# Altium schematic sheet 04. Z-WAVE.SchDoc
size A
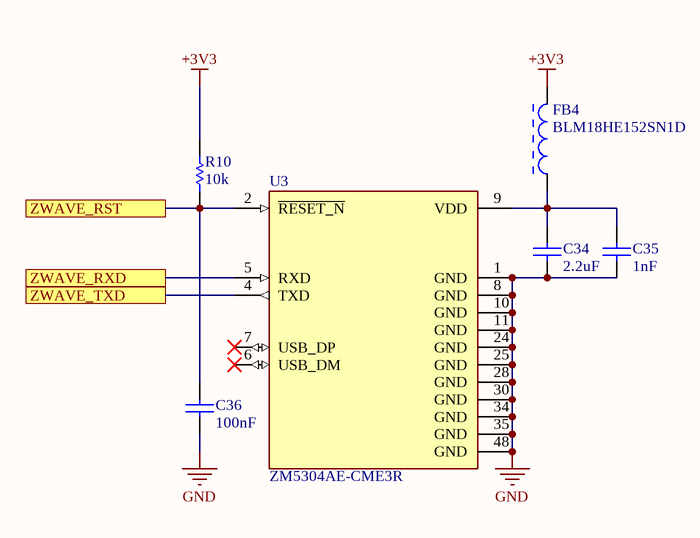
[diagram p0: 04. Z-WAVE.SchDoc]

## Parts
C34  2.2uF  [CAPC1608X90X35NL10T15]
C35  1nF  [CAPC1005X55X25NL05T10]
C36  100nF  [CAPC1005X56X25NL10T15]
FB4  BLM18HE152SN1D  [MURA-BLM18-RF-H4-CHIP-2_V]
R10  10k  [RESC1005X40X25NL05T05]
U3  ZM5304AE-CME3R  [ZM5304AE-CME3R]

## Ports
ZWAVE_RST, ZWAVE_RXD, ZWAVE_TXD

## Nets
+3V3: FB4.2 R10.2
GND: C34.1 C35.1 C36.1 U3.1(GND) U3.8(GND) U3.10(GND) U3.11(GND) U3.24(GND) U3.25(GND) U3.28(GND) U3.30(GND) U3.34(GND) U3.35(GND) U3.48(GND)
ZWAVE_RST: C36.2 R10.1 U3.2(~{RESET_N}) ; port ZWAVE_RST
ZWAVE_RXD: U3.5(RXD) ; port ZWAVE_RXD
ZWAVE_TXD: U3.4(TXD) ; port ZWAVE_TXD
NetC34_2: C34.2 C35.2 FB4.1 U3.9(VDD)

Not connected (* = marked no-connect by the designer): U3 6(USB_DM)* 7(USB_DP)*

## Library data of the parts
C34 = CMP-2006-02354-1: Manufacturer: Murata; Part Number: GCM188R70J225KE22D
C35 = CMP-2008-04254-1: Part Number: GRM1555C1H102JA01D; Manufacturer: Murata
C36 = CMP-2008-02743-1: Manufacturer: AVX Interconnect / Elco; Part Number: 04026D104KAT2A
FB4 = CMP-0686-00368-2: Chip Ferrite Bead for GHz Band High-speed Signal Lines, 1500 Ohm, 500 mA, -55 to 125 degC, 1.6 x 0.8 x 0.95 mm SMD, Tape and Reel; Manufacturer: Murata; Rated Current: 500 mA; Impedance (at 100 MHz): 1500 Ohm +/- 25%; DC Resistance: 0.50 Ohm Max.; Packing: Tape and Reel; DatasheetVersion: 08/2013; ComponentLink1URL: http://www.murata.com/; Mounting Technology: Surface Mount; ComponentLink2URL: http://www.murata.com/products/catalog/pdf/c31e.pdf; ComponentLink3Description: Package Specification; ComponentLink2Description: Datasheet; PackageReference: BLM18_H950-2; ComponentLink1Description: Manufacturer URL; PackageDescription: 2-Pin Chip, Body 1.6 x 0.8 mm; ComponentLink3URL: http://www.murata.com/products/catalog/pdf/c31e.pdf; PartNumber: BLM18HE152SN1D; Operating Temperature Range: -55 to 125 degC
R10 = CMP-2002-08135-1: Manufacturer: Vishay Dale; Part Number: CRCW040210K0FKED
U3 = ZM5304AE-CME3R: General ISM < 1GHz Z-WaveÂ® Transceiver Module 868MHz Surface Mount; MF: Silicon Labs; SnapEDA_Link: https://www.snapeda.com/parts/ZM5304AE-CME3R/Silicon%20Labs/view-part/214706/?ref=snap; Digi-Key_Part_Number: 703-1074-1-ND; MP: ZM5304AE-CME3R; Value: *; Package: Module Sigma Designs; Digi-Key_Purchase_URL: https://www.digikey.com/product-detail/en/silicon-labs/ZM5304AE-CME3R/703-1074-1-ND/4135431?utm_source=snapeda&utm_medium=aggregator&utm_campaign=symbol